# Altium schematic sheet HDMI_HDCP_SOCKET.SchDoc: HDMI HDCP Socket
size A4; Organization: Altium Limited.; Address1: Level 3, 12a Rodborough Rd; Address2: Frenchs Forest 2086; Address3: NSW; Address4: AUSTRALIA; DocumentNumber: 9; SheetNumber: 9; SheetTotal: 100
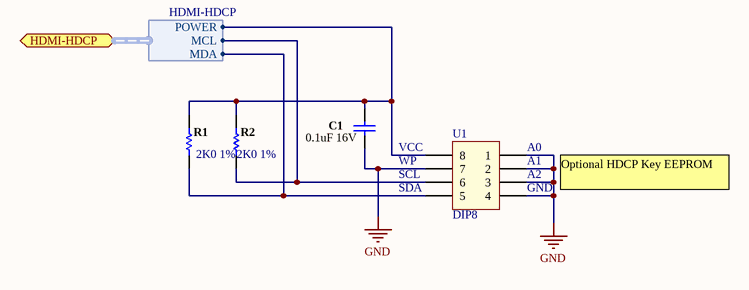
[diagram p0: HDMI_HDCP_SOCKET.SchDoc]

## Parts
C1  0.1uF 16V  [CAPC1005-STAR]
R1  2K0 1%  [RESC1005-STAR]
R2  2K0 1%  [RESC1005-STAR]
U1  DIP8  [DIP-8-SOCKET]

## Ports
HDMI-HDCP (harness HDMI-HDCP)

## Harnesses
HDMI-HDCP: POWER, MCL, MDA

## Nets
GND: C1.2 U1.1 U1.2 U1.3 U1.4 U1.7
NetC1_1: C1.1 R1.2 R2.2 U1.8 ; port HDMI-HDCP.POWER
NetR1_1: R1.1 U1.5 ; port HDMI-HDCP.MDA
NetR2_1: R2.1 U1.6 ; port HDMI-HDCP.MCL

## Notes on the sheet
- VCC
- (near U1) A0
- WP
- SCL
- (near U1) SDA
- (near U1) A1
- (near U1) A2
- (near U1) GND
- Optional HDCP Key EEPROM
- Sheet Title
- Project Title
- Size:
- Date:
- A4
- Assy:
- Time:
- Revision:
- Sheet
- of
- File:

## Library data of the parts
C1 = D-101-0080: Capacitor, Ceramic, 0.1uF 10% 16V 0402 (1005) X7R; Polarity: Non-Polarized; Capacitance: 0.1 uF; Category: Capacitor; Dielectric: X7R; Mounting Technology: Surface Mount; Rated Voltage: 16 V; Status: Production; Technology: Ceramic; Tolerance: 10 %
R1 R2 = D-100-0139: Resistor, 2K0 1% 0402 (1005); Power Rating: 63 mW; Resistance: 2.0 K; Mounting Technology: Surface Mount; Status: Unreleased; Tolerance: 1 %; Category: Resistor
U1 = D-300-0091: Socket, DIP8, Through-hole; Connector type: Header; Max Current: mA; Mounting Technology: Through-Hole; Status: Unreleased; Category: Connector; Pin Count: 8